# EAGLE design PSU (EAGLE 9.3.1)
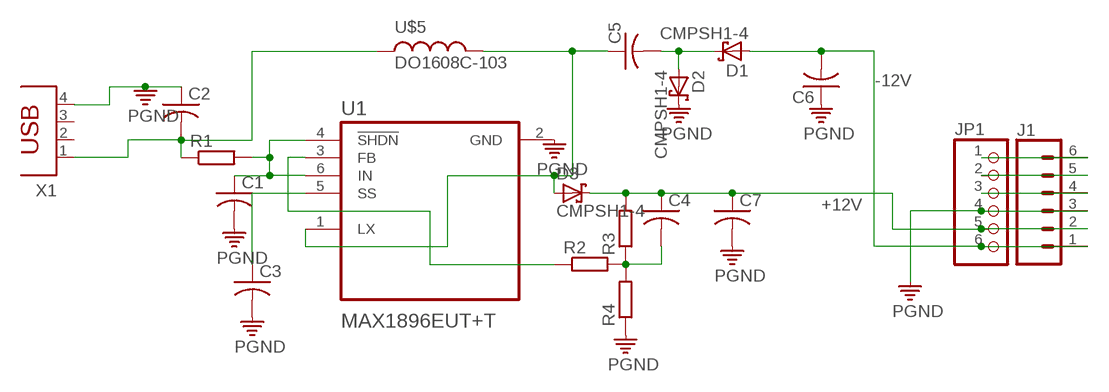
[diagram p0: schematic, sheet 1]

## Parts
C1  C-US025-025X050  [C025-025X050]
C2  C-US025-025X050  [C025-025X050]
C3  C-US025-025X050  [C025-025X050]
C4  C-US025-025X050  [C025-025X050]
C5  C-US025-025X050  [C025-025X050]
C6  C-US025-025X050  [C025-025X050]
C7  C-US025-025X050  [C025-025X050]
D1  CMPSH1-4  BAS70  [SOT23]
D2  CMPSH1-4  BAS70  [SOT23]
D3  CMPSH1-4  BAS70  [SOT23]
J1  CONN_06SMD-FEMALE-V2  [1X06-SMD-FEMALE]
JP1  PINHD-1X6/90  [1X06/90]
R1  R-EU_0309/10  [0309/10]
R2  R-EU_0309/10  [0309/10]
R3  R-EU_0309/10  [0309/10]
R4  R-EU_0309/10  [0309/10]
U1  MAX1896EUT+T  [SOT95P280X145-6N]
U$5  DO1608C-103  MSS1260  [MSS1260]
X1  PN61729  [PN61729]

## Nets
+12V: C4.1 C7.1 D3.3(C) J1.2 JP1.5 R3.2
-12V: C6.2 D1.1(A) J1.1 JP1.6
N$1: C1.1 R1.2 U1.4(!SHDN) U1.6(IN)
N$2: C4.2 R2.2 R3.1 R4.2
N$3: C2.2 R1.1 U$5.P$2 X1.1
N$4: R2.1 U1.3(FB)
N$5: C5.1 D3.1(A) U1.1(LX) U$5.P$1
N$7: C5.2 D1.3(C) D2.1(A)
N$9: J1.4 JP1.3
N$10: J1.5 JP1.2
N$11: C3.1 U1.5(SS)
N$12: J1.6 JP1.1
PGND: C1.2 C2.1 C3.2 C6.1 C7.2 D2.3(C) J1.3 JP1.4 R4.1 U1.2(GND) X1.4
Unconnected: X1.2 X1.3

## Library data of the parts
C1-C7 = adafruit:C-US: CAPACITOR, American symbol
D1-D3 = diode:BAS70: Silicon Schottky Diodes General-purpose diode for high-speed switching
J1 = SparkFun-Connectors:CONN_06: Multi connection point. Often used as Generic Header-pin footprint for 0.1 inch spaced/style header connections On any of the 0.1 inch spaced packages, you can populate with these: Break Away Headers - Straight <https://www.sparkfun.com/products/116> (PRT-00116) Break Away Male Headers - Right Angle <https://www.sparkfun.com/products/553> (PRT-00553) Female Headers <https://www.sparkfun.com/products/115> (PRT-00115) Break Away Headers - Machine Pin <https://www.sparkfun.com/products/117> (PRT-00117) Break Away Female Headers - Swiss Machine Pin <https://www.sparkfun.com/products/743> (PRT-00743) Arduino Stackable Header - 6 Pin <https://www.sparkfun.com/products/9280> (PRT-09280) For SCREWTERMINALS and SPRING TERMINALS visit here: Screw Terimnals on SparkFun.com <https://www.sparkfun.com/search/results?term=Screw+Terminals> (5mm/3.5mm/2.54mm spacing) This device is also useful as a general connection point to wire up your design to another part of your project. Our various solder wires solder well into these plated through hole pads. Hook-Up Wire - Assortment (Stranded, 22 AWG) <https://www.sparkfun.com/products/11375> (PRT-11375) Hook-Up Wire - Assortment (Solid Core, 22 AWG) <https://www.sparkfun.com/products/11367> (PRT-11367) View the entire wire category on our website here <https://www.sparkfun.com/categories/141>; PROD_ID: CONN-09668
JP1 = pinhead:PINHD-1X6: PIN HEADER
R1-R4 = rcl-2:R-EU_: RESISTOR, European symbol
U1 = MAX1896EUT_T:MAX1896EUT+T; DESCRIPTION: Conv DC-DC Single Step Up 2.6V to 5.5V 6-Pin SOT-23 T/R; DIGI-KEY_PART_NUMBER: MAX1896EUT+T-ND; DIGI-KEY_PURCHASE_URL: https://www.digikey.de/product-detail/en/maxim-integrated/MAX1896EUT-T/MAX1896EUT-T-ND/3829238?utm_source=snapeda&utm_medium=aggregator&utm_campaign=symbol; MF: Maxim Integrated; MP: MAX1896EUT+T; PACKAGE: SOT-23-6 Maxim
U$5 = inductor-coilcraft:MSS1260: SMT Power Inductor
X1 = con-berg:PN61729: BERG USB connector; OC_FARNELL: unknown; OC_NEWARK: unknown

## Board
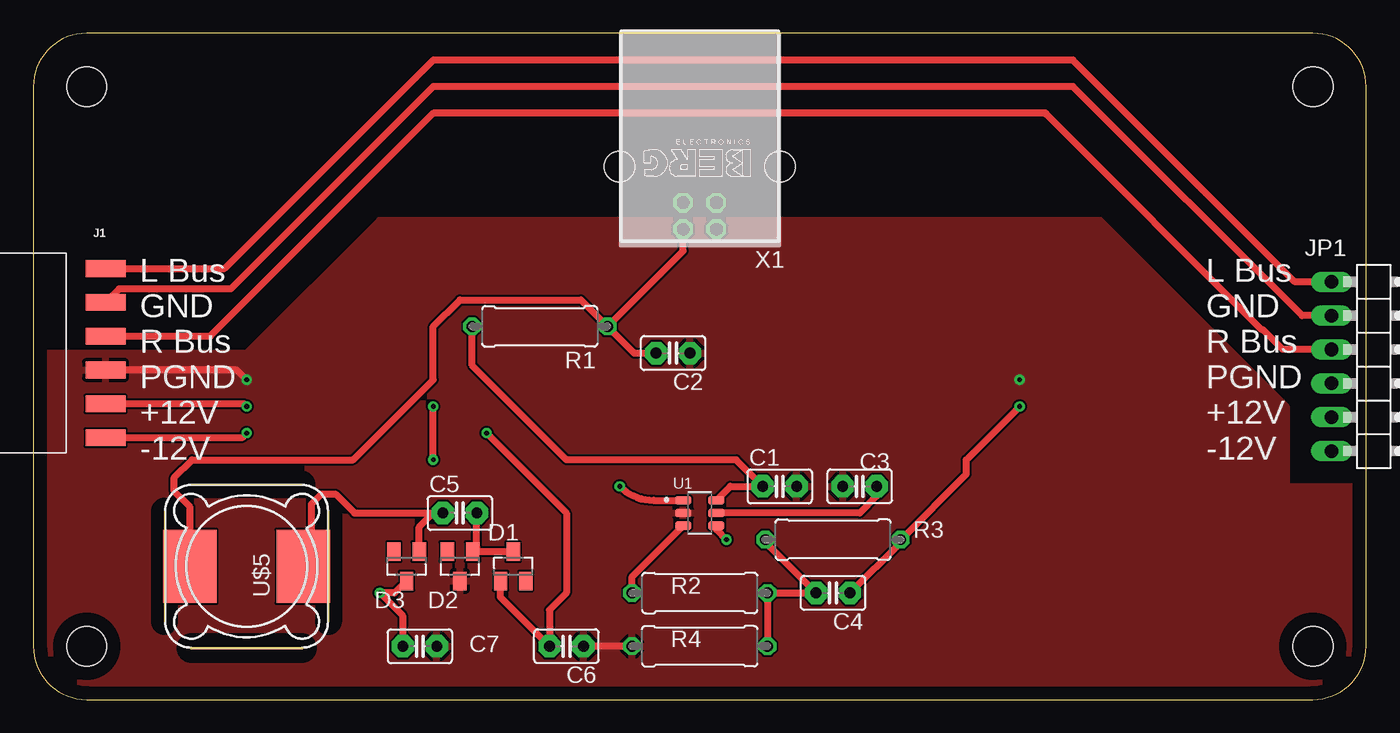
[diagram p1: board, top side]
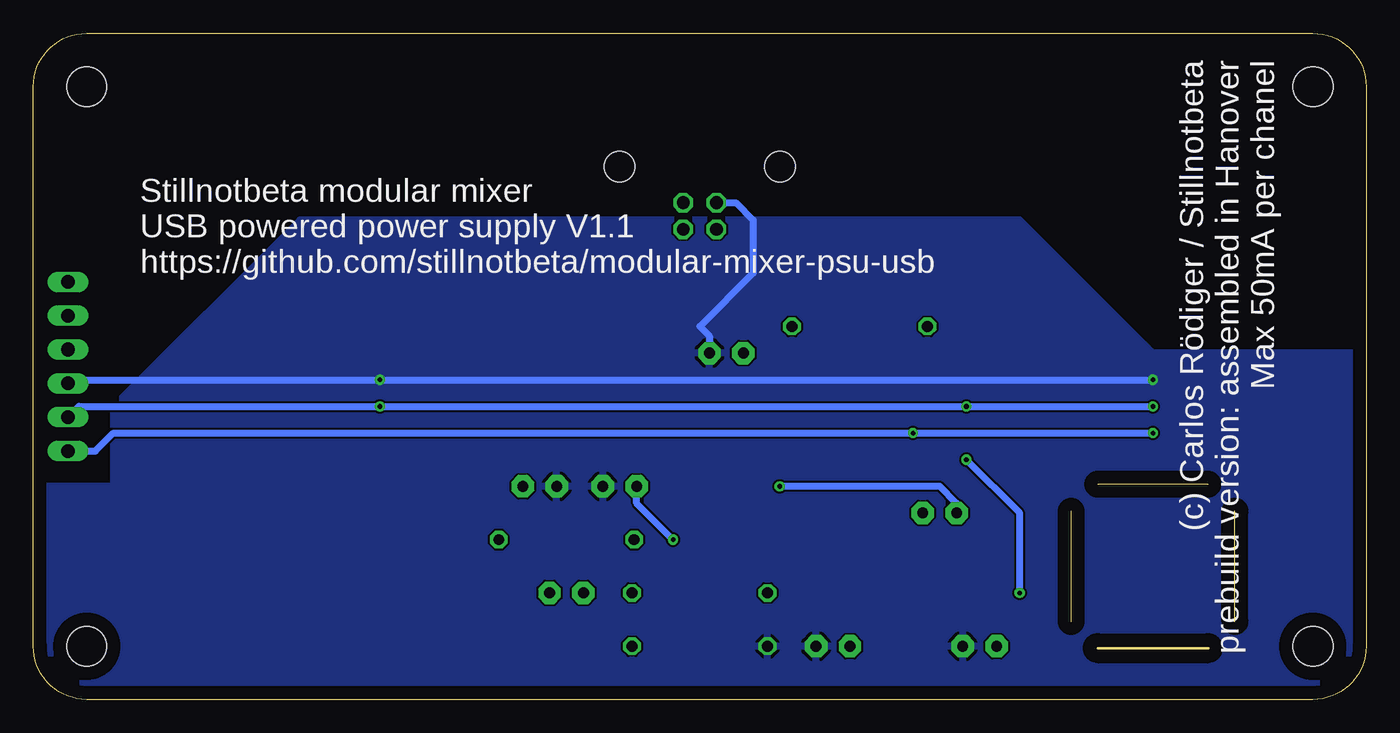
[diagram p2: board, bottom side, seen from below]

Size 100 x 50 mm. Coordinates in mm from the lower left corner, seen from the top.
Outline: 0,46 0,4 arc90 4,0 96,0 arc90 100,4 100,46 arc90 96,50 4,50 arc90 0,46
Copper layers (1*16): Top 0.035mm / dielectric 1.5mm / Bottom 0.035mm
Design rules "default": minimum track width 6mil, minimum drill 0.35mm, track to track 6mil, track to pad 6mil, pad to pad 6mil, via to via 6mil, smd to smd 6mil, copper to edge 40mil, drill to drill 6mil, minimum pad ring 10mil, minimum via ring 8mil, stop-mask expansion 4mil, vias tented up to drill 0mil, thermal gap 10mil
Holes 3 mm at 4,4 4,46 96,46 96,4

### Footprints (pad centres in the part's own frame; a part is rotated, then mirrored left to right if it is on the bottom)
C025-025X050 = drill 0.813 pad 1.676 octagon: 1 -1.27,0; 2 1.27,0
SOT23 = smd 1 x 1.4: 1 -0.95,-1.1; 2 0.95,-1.1; 3 0,1.1
1X06-SMD-FEMALE = smd 1.25 x 3: 1 6.35,3.425; 2 3.81,3.425; 3 1.27,3.425; 4 -1.27,3.425; 5 -3.81,3.425; 6 -6.35,3.425
1X06/90 = drill 1.016 long: 1 -6.35,-3.81; 2 -3.81,-3.81; 3 -1.27,-3.81; 4 1.27,-3.81; 5 3.81,-3.81; 6 6.35,-3.81
0309/10 = drill 0.813 octagon: 1 -5.08,0; 2 5.08,0
SOT95P280X145-6N = smd 1.22 x 0.6: 1 -1.245,0.95; 2 -1.245,0; 3 -1.245,-0.95; 4 1.245,-0.95; 5 1.245,0; 6 1.245,0.95
MSS1260 = smd 5.5 x 4: P$1 0,4.25; P$2 0,-4.25
PN61729 = drill 0.95 octagon: 1 1.25,4.71; 2 -1.25,4.71; 3 -1.25,2.71; 4 1.25,2.71 | hole 2.3: -6.02,0; 6.02,0

### Placement (x,y rotation side)
C1  56,16 0 top
C2  48,26 180 top
C3  62,16 180 top
C4  60,8 180 top
C5  32,14 0 top
C6  40,4 180 top
C7  29,4 0 top
D1  36,10 0 top
D2  32,10 180 top
D3  28,10 180 top
J1  2,26 270 top
JP1  101.2,25 270 top
R1  38,28 180 top
R2  50,8 0 top
R3  60,12 0 top
R4  50,4 0 top
U1  50,14 0 top
U$5  16,10 270 top
X1  50,40 180 top

### Tracks (layer width: path | path; a pad name or v marks a point on that pad's centre or on a via)
+12V  (via drill 0.35)
  Top 0.508: v16,22 15.81,22.19 J1.2 | C4.1 65.08,11.81 R3.2 70,16.92 70,18 v74,22 | D3.3 27.1,8 v26,8 27.73,6.27 C7.1 | v30,18 v30,22
  Bottom 0.508: JP1.5 96.58,22 v74,22 v30,22 v16,22 | v26,8 26,14 v30,18
-12V  (via drill 0.35)
  Top 0.508: v16,20 15.65,19.65 J1.1 | D1.1 35.05,7.68 C6.2 38.73,6.73 40,8 40,14 v34,20
  Bottom 0.508: JP1.6 95.35,18.65 94,20 v34,20 v16,20
N$1  (via drill 0.35)
  Top 0.508: U1.6 52.3,16 C1.1 52.73,18 40,18 32.92,25.08 R1.2 | U1.4 51.24,12.76 v52,12
  Bottom 0.508: v52,12 54.73,14.73 C1.1
N$2
  Top 0.508: R4.2 R2.2 C4.2 54.92,11.81 R3.1
N$3
  Top 0.508: R1.1 45.08,26 C2.2 46.5,26.23 | U$5.P$2 11.75,14.45 10.58,15.62 10.58,16.68 11.9,18 24,18 30,24 30,28 32,30 41.08,30 R1.1 | R1.1 48.75,33.67 X1.1
N$4
  Top 0.508: R2.1 44.92,9.21 U1.3
N$5  (via drill 0.35)
  Top 0.508: D3.1 28.95,12.95 30,14 C5.1 24.1,14 22.68,15.42 21.62,15.42 20.88,14.68 20.88,10.63 U$5.P$1 | v44,16 arc45 46.53,14.95 U1.1
  Bottom 0.508: C5.1 30.73,14.73 32,16 v44,16
N$7
  Top 0.508: D1.3 D2.1 33.27,11.42 C5.2
N$9
  Top 0.508: J1.4 13.27,27.27 30,44 76,44 76,43.92 92.18,27.73 92.27,27.73 93.73,26.27 JP1.3
N$10
  Top 0.508: JP1.2 95.19,28.81 78,46 30,46 14.81,30.81 6.42,30.81 J1.5
N$11
  Top 0.508: C3.1 63.27,15.27 62,14 U1.5
N$12
  Top 0.508: J1.6 14.35,32.35 30,48 78,48 94.65,31.35 JP1.1
PGND  (via drill 0.35)
  Top 0.508: v16,24 15.27,24.73 J1.3 | R4.1 C6.1
  Bottom 0.508: JP1.4 97.12,24 v74,24 v16,24 | X1.4 47.29,37.29 46,36 46,32 50,28 49.27,27.27 C2.1
  pour Top: 0,26 16,26 26,36 80,36 94,22 94,16 100,16 100,4 arc-90 96,0 4,0 arc-90 0,4
  pour Bottom: 0,26 16,26 26,36 80,36 94,22 94,16 100,16 100,4 arc-90 96,0 4,0 arc-90 0,4

### Text on the board
_tsilk: L Bus / GND / R Bus / PGND / +12V / -12V | L Bus / GND / R Bus / PGND / +12V / -12V
_bsilk: (c) Carlos Rödiger / Stillnotbeta / prebuild version: assembled in Hanover / Max 50mA per chanel | Stillnotbeta modular mixer / USB powered power supply V1.1 / https://github.com/stillnotbeta/modular-mixer-psu-usb